# Altium schematic sheet 4_CONN.schdoc.schdoc
size 431 x 309 mm; Symbol: Sheet-Symbol_A3; Device: Sheet-Symbol_A3; Company: 嘉立创EDA; Version: V1.0; Page Size: A3; @Project Name: V3S_LCD; @Page Count: 4; @Update Date: 2023-12-17; @Create Date: 2023-12-16; @Schematic Name: Schematic1; @Page No: 4; @Page Name: CONN
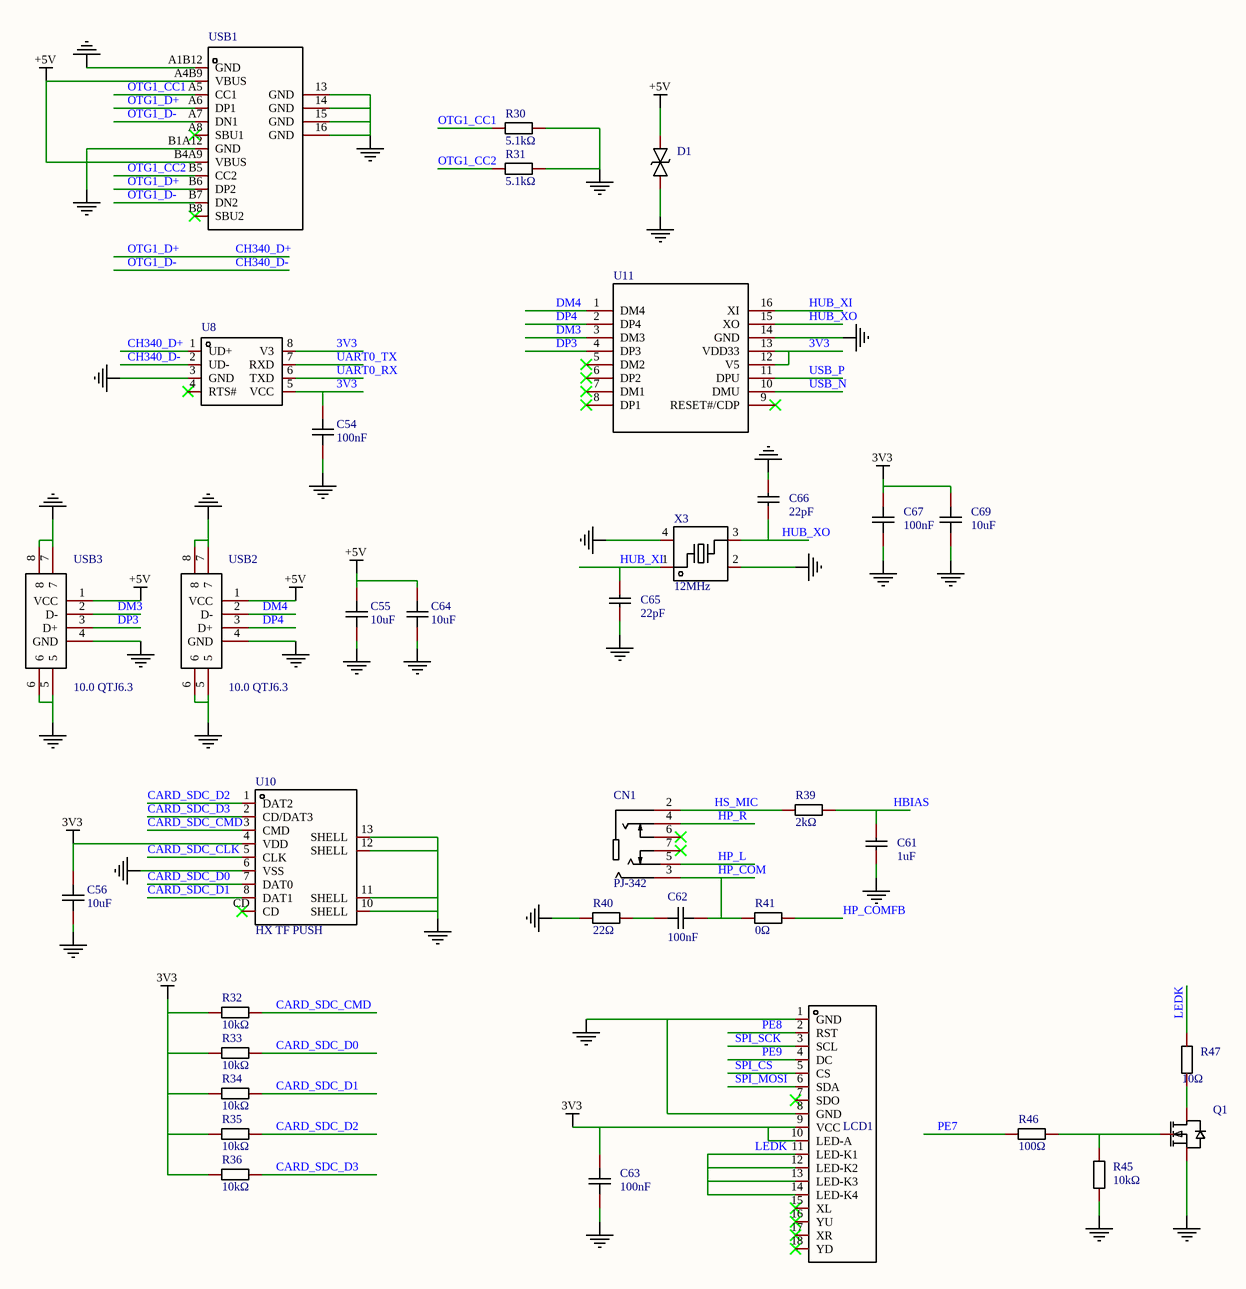
[diagram p0: 4_CONN.schdoc.schdoc]

## Parts
C54  100nF  [C0603]
C55  10uF  [C0603]
C56  10uF  [C0603]
C61  1uF  [C0603]
C62  100nF  [C0603]
C63  100nF  [C0603]
C64  10uF  [C0603]
C65  22pF  [C0603]
C66  22pF  [C0603]
C67  100nF  [C0603]
C69  10uF  [C0603]
CN1  PJ-342  [AUDIO-SMD_PJ-342]
D1  SMF5.0CA  [SOD-123_L2.7-W1.8-LS3.7-BI]  (value not drawn)
LCD1  TFT_2.4_18P_SPI_ILI9341_240X320_65K_S_1  [TFT_2.4_18P_SPI_ILI9341_240X320_65K_S_1]  (value not drawn)
Q1  ao3400_c841146  [SOT-23-3_L2.9-W1.3-P1.90-LS2.4-BR]  (value not drawn)
R30  5.1kΩ  [R0402]
R31  5.1kΩ  [R0402]
R32  10kΩ  [R0603]
R33  10kΩ  [R0603]
R34  10kΩ  [R0603]
R35  10kΩ  [R0603]
R36  10kΩ  [R0603]
R39  2kΩ  [R0603]
R40  22Ω  [R0603]
R41  0Ω  [R0603]
R45  10kΩ  [R0603]
R46  100Ω  [R0603]
R47  10Ω  [R0603]
U8  CH340N  [SOP-8_L4.9-W3.9-P1.27-LS6.0-BL]  (value not drawn)
U10  HX TF PUSH  [TF-SMD_TF-PUSH]
U11  CH334R  [QSOP-16_L4.9-W3.9-P0.635-LS6.0-BL]  (value not drawn)
USB1  TYPEC-304-BCP16  [USB-C-SMD_TYPEC-304-BCP16]  (value not drawn)
USB2  10.0 QTJ6.3  [USB-A-SMD_10.0-QTJ6.3]
USB3  10.0 QTJ6.3  [USB-A-SMD_10.0-QTJ6.3]
X3  12MHz  [OSC-SMD_4P-L3.2-W2.5-BL]

## Nets
3V3: C54.2 C56.2 C63.2 C67.2 C69.2 LCD1.9(VCC) LCD1.10(LED-A) R32.1 R33.1 R34.1 R35.1 R36.1 U8.5(VCC) U8.8(V3) U10.4(VDD) U11.12(V5) U11.13(VDD33)
+5V: C55.2 C64.2 D1.2 USB1.A4B9(VBUS) USB1.B4A9(VBUS) USB2.1(VCC) USB3.1(VCC)
GND: C54.1 C65.1 C66.2 D1.1 R30.2 R31.2 U8.3(GND) USB1.13(GND) USB1.14(GND) USB1.15(GND) USB1.16(GND) USB1.A1B12(GND) USB1.B1A12(GND) X3.2(GND) X3.4(GND)
NetC55_1: C55.1 C56.1 C61.1 C63.1 C64.1 C67.1 C69.1 LCD1.1(GND) LCD1.8(GND) Q1.2(S) R40.1 R45.1 U10.6(VSS) U10.10(SHELL) U10.11(SHELL) U10.12(SHELL) U10.13(SHELL) U11.14(GND) USB2.4(GND) USB2.5 USB2.6 USB2.7 USB2.8 USB3.4(GND) USB3.5 USB3.6 USB3.7 USB3.8
CARD_SDC_CLK: U10.5(CLK)
CARD_SDC_CMD: R32.2 U10.3(CMD)
CARD_SDC_D0: R33.2 U10.7(DAT0)
CARD_SDC_D1: R34.2 U10.8(DAT1)
CARD_SDC_D2: R35.2 U10.1(DAT2)
CARD_SDC_D3: R36.2 U10.2(CD/DAT3)
CH340_D+: U8.1(UD+) USB1.A6(DP1) USB1.B6(DP2)  [also labelled OTG1_D+]
CH340_D-: U8.2(UD-) USB1.A7(DN1) USB1.B7(DN2)  [also labelled OTG1_D-]
DM3: U11.3(DM3) USB3.2(D-)
DM4: U11.1(DM4) USB2.2(D-)
DP3: U11.4(DP3) USB3.3(D+)
DP4: U11.2(DP4) USB2.3(D+)
HBIAS: C61.2 R39.2
HP_COM: C62.1 CN1.3 R41.1
HP_COMFB: R41.2
HP_L: CN1.5
HP_R: CN1.4
HS_MIC: CN1.2 R39.1
HUB_XI: C65.2 U11.16(XI) X3.1
HUB_XO: C66.1 U11.15(XO) X3.3
LEDK: LCD1.11(LED-K1) LCD1.12(LED-K2) LCD1.13(LED-K3) LCD1.14(LED-K4) R47.2
OTG1_CC1: R30.1 USB1.A5(CC1)
OTG1_CC2: R31.1 USB1.B5(CC2)
PE7: R46.1
PE8: LCD1.2(RST)
PE9: LCD1.4(DC)
SPI_CS: LCD1.5(CS)
SPI_MOSI: LCD1.6(SDA)
SPI_SCK: LCD1.3(SCL)
UART0_RX: U8.6(TXD)
UART0_TX: U8.7(RXD)
USB_N: U11.10(DMU)
USB_P: U11.11(DPU)
NetC62_2: C62.2 R40.2
NetQ1_1: Q1.1(G) R45.2 R46.2
NetQ1_3: Q1.3(D) R47.1

Not connected (* = marked no-connect by the designer): CN1 6* 7*; LCD1 7(SDO)* 15(XL)* 16(YU)* 17(XR)* 18(YD)*; U8 4(RTS#)*; U10 CD*; U11 5(DM2)* 6(DP2)* 7(DM1)* 8(DP1)* 9(RESET#/CDP)*; USB1 A8(SBU1)* B8(SBU2)*

## Notes on the sheet
- 1
- 2
- 3
- 4
- 5
- 6
- A
- B
- C
- 原理图
- Schematic1
- 创建日期
- 更新日期
- 2023-12-17
- 2023-12-16
- D
- 审阅
- 绘制
- 图页
- CONN
- 物料编码
- V3S_LCD
- 版本
- 尺寸
- 页
- 共
- V1.0
- A3
- 嘉立创EDA

## Library data of the parts
C54 C62 C63 C67 = CC0603KRX7R9BB104: Manufacturer: YAGEO(国巨); Add into BOM: yes; Tolerance: ±10%; Voltage Rated: 50V; Temperature Coefficient: X7R; Description: 容值:100nF;精度:±10%;额定电压:50V;材质(温度系数):X7R;; Name: 100nF; Symbol: CC0603KRX7R9BB104; Device: CC0603KRX7R9BB104; Supplier: LCSC; Manufacturer Part: CC0603KRX7R9BB104; Value: 100nF; Supplier Part: C14663; JLCPCB Part Class: Basic Part; LCSC Part Name: 100nF ±10% 50V; Supplier Footprint: 0603; Datasheet: https://atta.szlcsc.com/upload/public/pdf/source/20180910/C282072_33301C7F631E79921B82A8DAC6BCC5B3.pdf; Convert to PCB: yes
C55 C56 C64 C69 = CL10A106KP8NNNC: Manufacturer: SAMSUNG(三星); Add into BOM: yes; Tolerance: ±10%; Voltage Rated: 10V; Temperature Coefficient: X5R; Description: 容值:10uF;精度:±10%;额定电压:10V;材质(温度系数):X5R;; Name: 10uF; Symbol: CL10A106KP8NNNC; Device: CL10A106KP8NNNC; Supplier: LCSC; Manufacturer Part: CL10A106KP8NNNC; Value: 10uF; Supplier Part: C19702; LCSC Part Name: 10uF ±10% 10V; Supplier Footprint: 0603; Convert to PCB: yes
  C55 C56 C64: JLCPCB Part Class: Basic Part; Datasheet: https://atta.szlcsc.com/upload/public/pdf/source/20160103/1457707703378.pdf
  C69: JLCPCB Part Class: 基础库; Datasheet: https://atta.szlcsc.com/upload/public/pdf/source/20160218/1457707763339.pdf
C61 = CL10A105KB8NNNC: Manufacturer: SAMSUNG(三星); Add into BOM: yes; Tolerance: ±10%; Voltage Rated: 50V; Temperature Coefficient: X5R; Description: 容值:1uF;精度:±10%;额定电压:50V;材质(温度系数):X5R;; Name: 1uF; Symbol: CL10A105KB8NNNC; Device: CL10A105KB8NNNC; Supplier: LCSC; Manufacturer Part: CL10A105KB8NNNC; Value: 1uF; Supplier Part: C15849; JLCPCB Part Class: Basic Part; LCSC Part Name: 1uF ±10% 50V; Supplier Footprint: 0603; Datasheet: https://atta.szlcsc.com/upload/public/pdf/source/20160218/1457707763339.pdf; Convert to PCB: yes
C65 C66 = CL10C220JB8NNNC: Manufacturer: SAMSUNG(三星); Add into BOM: yes; Tolerance: ±5%; Voltage Rated: 50V; Temperature Coefficient: C0G; Description: 容值:22pF;精度:±5%;额定电压:50V;材质(温度系数):C0G;; Name: 22pF; Symbol: CL10C220JB8NNNC; Device: CL10C220JB8NNNC; Supplier: LCSC; Manufacturer Part: CL10C220JB8NNNC; Value: 22pF; Supplier Part: C1653; JLCPCB Part Class: 基础库; LCSC Part Name: 22pF ±5% 50V; Supplier Footprint: 0603; Datasheet: https://atta.szlcsc.com/upload/public/pdf/source/20160218/1457707763339.pdf; Convert to PCB: yes
CN1 = PJ-342_C668606: Manufacturer: SHOU HAN(首韩); Add into BOM: yes; Connector Type: 3.5mm耳机座; Current Rating (Max): 500mA; Voltage Rating (Max): 30V; Description: 连接器类型:3.5mm耳机座;额定电流:500mA;额定电压:30V;工作温度范围:-30℃~+70℃;; Name: PJ-342; Symbol: PJ-342; Device: PJ-342_C668606; LCSC Part Name: 3.5mm耳机座; Supplier Part: C668606; Manufacturer Part: PJ-342; Supplier Footprint: SMD; JLCPCB Part Class: 扩展库; Datasheet: https://atta.szlcsc.com/upload/public/pdf/source/20200618/C668606_D9051A7D9D1D8CCDEAA76A8E7BC279ED.pdf; Supplier: LCSC; Convert to PCB: yes; Operating Temperature Range: -30℃~+70℃
D1 = SMF5.0CA_C435453: 极性:双向;反向截止电压(Vrwm):5V;击穿电压:6.4V;反向漏电流(Ir):800uA;峰值脉冲电流(Ipp)@10/1000μs:21.7A;最大钳位电压:9.2V;; Manufacturer: AnBon(安邦); Add into BOM: yes; Polarity: 双向; Reverse Stand-Off Voltage (Vrwm): 5V; Breakdown Voltage: 6.4V; Reverse Leakage Current (Ir): 800uA; Peak Pulse Current (Ipp)@10/1000μs: 21.7A; Maximum Clamping Voltage: 9.2V; Name: SMF5.0CA; Symbol: SMF5.0CA_C435453; Device: SMF5.0CA_C435453; LCSC Part Name: 双向 Vrwm:5V; Supplier Part: C435453; Manufacturer Part: SMF5.0CA; Supplier Footprint: SOD-123; JLCPCB Part Class: Extended Part; Datasheet: https://atta.szlcsc.com/upload/public/pdf/source/20191009/C435453_6D1091435A92BAD2FCEBAFDAD46121CC.pdf; Supplier: LCSC; Convert to PCB: yes
LCD1 = TFT_2.4_18P_SPI_ILI9341_240X320_65K_S_1: Add into BOM: yes; Description: 2.4寸SPI串口液晶屏TFT彩屏ILI9341驱动; Symbol: TFT_2.4_18P_SPI_ILI9341_240X320_65K_S_1; Device: TFT_2.4_18P_SPI_ILI9341_240X320_65K_S_1; Convert to PCB: yes
Q1 = ao3400_c841146: 类型:N沟道;漏源电压(Vdss):30V;连续漏极电流(Id):5.8A;功率(Pd):1.4W;导通电阻(RDS(on)@Vgs,Id):28m@10V,2.9A;阈值电压(Vgs(th)@Id):900mV@250uA;栅极电荷(Qg@Vgs):9.5nC@4.5V;输入电容(Ciss@Vds):623pF@15V;反向传输电容(Crss@Vds):77pF@15V;工作温度:-55~+150@(Tj);; Manufacturer: LGE(鲁光); Manufacturer Part: AO3400; Add into BOM: yes; Type: N沟道; Drain Source Voltage (Vdss): 30V; Continuous Drain Current (Id): 5.8A; Power Dissipation (Pd): 1.4W; Symbol: AO3400_C841146; Device: ao3400_c841146; Supplier: LCSC; Supplier Part: C841146; JLCPCB Part Class: Extended Part; LCSC Part Name: N沟道 30V 5.8A; Supplier Footprint: SOT-23; Datasheet: https://atta.szlcsc.com/upload/public/pdf/source/20200922/C841146_922AA0BEFDBB3A3B608547560AFF8EA3.pdf; Convert to PCB: yes; Drain Source On Resistance (RDS(on)@Vgs,Id): 28m@10V,2.9A; Gate Threshold Voltage (Vgs(th)@Id): 900mV@250uA; Total Gate Charge (Qg@Vgs): 9.5nC@4.5V; Input Capacitance (Ciss@Vds): 623pF@15V; Reverse Transfer Capacitance (Crss@Vds): 77pF@15V; Operating Temperature: -55~+150@(Tj)
R30 R31 = 0402WGF5101TCE: Manufacturer: UNI-ROYAL(厚声); Add into BOM: yes; Tolerance: ±1%; Power(Watts): 62.5mW; Overload Voltage (Max): 50V; Temperature Coefficient: ±100ppm/℃; Description: 阻值:5.1kΩ;精度:±1%;功率:62.5mW;温度系数:±100ppm/℃;电阻类型:厚膜电阻;; Name: 5.1kΩ; Symbol: 0402WGF5101TCE; Device: 0402WGF5101TCE; Supplier: LCSC; Manufacturer Part: 0402WGF5101TCE; Supplier Part: C25905; Value: 5.1kΩ; JLCPCB Part Class: 基础库; LCSC Part Name: 5.1kΩ ±1% 62.5mW 厚膜电阻; Supplier Footprint: 0402; Datasheet: https://atta.szlcsc.com/upload/public/pdf/source/20200306/C422600_1E6D84923E4A46A82E41ADD87F860B5C.pdf; Convert to PCB: yes; Type: 厚膜电阻; Operating Temperature Range: -55℃~+155℃
R32-R36 = 0603WAF1002T5E: 电阻类型:厚膜电阻;阻值:10kΩ;精度:±1%;功率:100mW;温度系数:±100ppm/℃;最大工作电压:75V;工作温度范围:-55℃~+155℃;; Manufacturer: UNI-ROYAL(厚声); Add into BOM: yes; Tolerance: ±1%; Power(Watts): 100mW; Overload Voltage (Max): 75V; Name: 10kΩ; Symbol: 0603WAF1002T5E; Device: 0603WAF1002T5E; Supplier: LCSC; Manufacturer Part: 0603WAF1002T5E; Supplier Part: C25804; Value: 10kΩ; JLCPCB Part Class: Basic Part; LCSC Part Name: 10kΩ ±1% 100mW; Supplier Footprint: 0603; Datasheet: https://atta.szlcsc.com/upload/public/pdf/source/20200306/C422600_1E6D84923E4A46A82E41ADD87F860B5C.pdf; Convert to PCB: yes; Temperature Coefficient: ±100ppm/℃; Type: 厚膜电阻; Operating Temperature Range: -55℃~+155℃
R39 = 0603WAF2001T5E: Manufacturer: UNI-ROYAL(厚声); Add into BOM: yes; Tolerance: ±1%; Power(Watts): 100mW; Overload Voltage (Max): 75V; Temperature Coefficient: ±100ppm/℃; Description: 阻值:2kΩ;精度:±1%;功率:100mW;温度系数:±100ppm/℃;电阻类型:厚膜电阻;; Name: 2kΩ; Symbol: 0603WAF2001T5E; Device: 0603WAF2001T5E; Supplier: LCSC; Manufacturer Part: 0603WAF2001T5E; Supplier Part: C22975; Value: 2kΩ; JLCPCB Part Class: Basic Part; LCSC Part Name: 2kΩ ±1% 100mW 厚膜电阻; Supplier Footprint: 0603; Datasheet: https://atta.szlcsc.com/upload/public/pdf/source/20200306/C422600_1E6D84923E4A46A82E41ADD87F860B5C.pdf; Convert to PCB: yes; Type: 厚膜电阻; Operating Temperature Range: -55℃~+155℃
R40 = 0603WAF220JT5E: Manufacturer: UNI-ROYAL(厚声); Add into BOM: yes; Tolerance: ±1%; Power(Watts): 100mW; Overload Voltage (Max): 75V; Temperature Coefficient: ±100ppm/℃; Description: 阻值:22Ω;精度:±1%;功率:100mW;温度系数:±100ppm/℃;电阻类型:厚膜电阻;; Name: 22Ω; Symbol: 0603WAF220JT5E; Device: 0603WAF220JT5E; Supplier: LCSC; Manufacturer Part: 0603WAF220JT5E; Supplier Part: C23345; Value: 22Ω; JLCPCB Part Class: Basic Part; LCSC Part Name: 22Ω ±1% 100mW 厚膜电阻; Supplier Footprint: 0603; Datasheet: https://atta.szlcsc.com/upload/public/pdf/source/20200306/C422600_1E6D84923E4A46A82E41ADD87F860B5C.pdf; Convert to PCB: yes; Type: 厚膜电阻; Operating Temperature Range: -55℃~+155℃
R41 = 0603WAF0000T5E: Manufacturer: UNI-ROYAL(厚声); Add into BOM: yes; Tolerance: ±1%; Power(Watts): 100mW; Overload Voltage (Max): 75V; Description: 阻值:0Ω;精度:±1%;功率:100mW;电阻类型:厚膜电阻;; Name: 0Ω; Symbol: 0603WAF0000T5E; Device: 0603WAF0000T5E; Supplier: LCSC; Manufacturer Part: 0603WAF0000T5E; Supplier Part: C21189; Value: 0Ω; JLCPCB Part Class: Basic Part; LCSC Part Name: 0Ω ±1% 100mW 厚膜电阻; Supplier Footprint: 0603; Datasheet: https://atta.szlcsc.com/upload/public/pdf/source/20200306/C422600_1E6D84923E4A46A82E41ADD87F860B5C.pdf; Convert to PCB: yes; Type: 厚膜电阻; Operating Temperature Range: -55℃~+155℃
R45 = 0603WAF1002T5E: Manufacturer: UNI-ROYAL(厚声); Add into BOM: yes; Tolerance: ±1%; Power(Watts): 100mW; Overload Voltage (Max): 75V; Temperature Coefficient: ±100ppm/℃; Description: 阻值:10kΩ;精度:±1%;功率:100mW;温度系数:±100ppm/℃;电阻类型:厚膜电阻;; Name: 10kΩ; Symbol: 0603WAF1002T5E; Device: 0603WAF1002T5E; Supplier: LCSC; Manufacturer Part: 0603WAF1002T5E; Supplier Part: C25804; Value: 10kΩ; JLCPCB Part Class: Basic Part; LCSC Part Name: 10kΩ ±1% 100mW 厚膜电阻; Supplier Footprint: 0603; Datasheet: https://atta.szlcsc.com/upload/public/pdf/source/20200306/C422600_1E6D84923E4A46A82E41ADD87F860B5C.pdf; Convert to PCB: yes; Type: 厚膜电阻; Operating Temperature Range: -55℃~+155℃
R46 = 0603WAF1000T5E: Manufacturer: UNI-ROYAL(厚声); Add into BOM: yes; Tolerance: ±1%; Power(Watts): 100mW; Overload Voltage (Max): 75V; Temperature Coefficient: ±200ppm/℃; Description: 阻值:100Ω;精度:±1%;功率:100mW;温度系数:±200ppm/℃;电阻类型:厚膜电阻;; Name: 100Ω; Symbol: 0603WAF1000T5E; Device: 0603WAF1000T5E; Supplier: LCSC; Manufacturer Part: 0603WAF1000T5E; Supplier Part: C22775; Value: 100Ω; JLCPCB Part Class: Basic Part; LCSC Part Name: 100Ω ±1% 100mW 厚膜电阻; Supplier Footprint: 0603; Datasheet: https://atta.szlcsc.com/upload/public/pdf/source/20200306/C422600_1E6D84923E4A46A82E41ADD87F860B5C.pdf; Convert to PCB: yes; Type: 厚膜电阻; Operating Temperature Range: -55℃~+155℃
R47 = 0603WAF100JT5E: Manufacturer: UNI-ROYAL(厚声); Add into BOM: yes; Tolerance: ±1%; Power(Watts): 100mW; Temperature Coefficient: ±400ppm/℃; Overload Voltage (Max): 75V; Description: 电阻类型:厚膜电阻;阻值:10Ω;精度:±1%;功率:100mW;温度系数:±400ppm/℃;最大工作电压:75V;工作温度范围:-55℃~+155℃;; Name: 10Ω; Symbol: 0603WAF100JT5E; Device: 0603WAF100JT5E; LCSC Part Name: 10Ω ±1% 100mW; Supplier Part: C22859; Manufacturer Part: 0603WAF100JT5E; Supplier Footprint: 0603; JLCPCB Part Class: Basic Part; Datasheet: https://atta.szlcsc.com/upload/public/pdf/source/20200306/C422600_1E6D84923E4A46A82E41ADD87F860B5C.pdf; Supplier: LCSC; Convert to PCB: yes; Type: 厚膜电阻; Value: 10Ω; Operating Temperature Range: -55℃~+155℃
U8 = CH340N: Manufacturer: WCH(南京沁恒); Symbol: CH340N_C2977777; Add into BOM: yes; Device: CH340N; Supplier: LCSC; Supplier Part: C2977777; Manufacturer Part: CH340N; JLCPCB Part Class: Extended Part; LCSC Part Name: CH340N; Supplier Footprint: SOP-8; Datasheet: https://atta.szlcsc.com/upload/public/pdf/source/20220223/82A45E4FF89B3EDCAD50B354450A7EF4.pdf; Convert to PCB: yes
U10 = HX TF PUSH: Manufacturer: hanxia(韩下); Add into BOM: yes; Name: HX TF PUSH; Symbol: HX TF PUSH; Device: HX TF PUSH; LCSC Part Name: 自弹式TF卡座 TF外焊式内存卡卡座 带丝印; Supplier Part: C5184837; Manufacturer Part: HX TF PUSH; Supplier Footprint: SMD; JLCPCB Part Class: Extended Part; Datasheet: https://atta.szlcsc.com/upload/public/pdf/source/20221008/37482DBF64DAC27DC2B42D30360A57C3.pdf; Supplier: LCSC; Convert to PCB: yes
U11 = CH334R: Convert to PCB: yes; Symbol: CH334R; Device: CH334R; Add into BOM: yes
USB1 = TYPEC-304-BCP16_C720629: Manufacturer: XUNPU(讯普); Add into BOM: yes; Connector Type: Type-C; Gender: 母座; Number of Contacts: 16; Number of Ports: 1; Current Rating - Power (Max): 3A; Welding Temperature (Max): 260℃; Description: 连接器类型:Type-C;标准:USB 3.1;公母:母座;触点数量:16;端口数量:1;安装方式:卧贴;额定电流 - 电源:3A;工作温度范围:-25℃~+85℃;焊接温度(最大值):260℃;; Name: TYPEC-304-BCP16; Symbol: TYPEC-304-BCP16; Device: TYPEC-304-BCP16_C720629; Supplier: LCSC; Supplier Part: C720629; Manufacturer Part: TYPEC-304-BCP16; JLCPCB Part Class: Extended Part; LCSC Part Name: Type-C 母座 卧贴 停产 停产; Supplier Footprint: SMD; Datasheet: https://atta.szlcsc.com/upload/public/pdf/source/20220210/1FE0FEFF7D6A20C111212527D3DED014.pdf; Convert to PCB: yes; Standard: USB 3.1; Mounting Style: 卧贴; Operating Temperature Range: -25℃~+85℃
USB2 USB3 = 10.0 QTJ6.3: Manufacturer: SHOU HAN(首韩); Add into BOM: yes; Connector Type: Type-A; Gender: 母; Number of Contacts: 4P; Number of Ports: 1; Description: 连接器类型:Type-A;标准:USB 2.0;公母:母;触点数量:4P;端口数量:1;安装方式:卧贴;额定电流 - 电源:-;工作温度范围:-;; Name: 10.0 QTJ6.3; Symbol: 10.0 QTJ6.3; Device: 10.0 QTJ6.3; Supplier: LCSC; Supplier Part: C404966; Manufacturer Part: 10.0 QTJ6.3; JLCPCB Part Class: 扩展库; LCSC Part Name: Type-A 母 卧贴 短体180度全贴片式 铁壳LCP黑胶6,3 卷边; Supplier Footprint: SMD; Datasheet: https://atta.szlcsc.com/upload/public/pdf/source/20190722/C404966_79EC905EA469D8992CE6A4D8B32C5E15.pdf; Convert to PCB: yes; Standard: USB 2.0; Mounting Style: 卧贴; Current Rating - Power (Max): -; Operating Temperature Range: -
X3 = XL2EL89COI-111YLC-12M: Manufacturer: YXC(扬兴晶振); Add into BOM: yes; Crystal Type: 贴片无源晶振; Load Capacitance: 12pF; Frequency Tolerance: ±10ppm; Description: 频率:12MHz;负载电容:12pF;频率公差:±10ppm;; Name: 12MHz; Symbol: XL2EL89COI-111YLC-12M; Device: XL2EL89COI-111YLC-12M; Supplier: LCSC; Supplier Part: C5280578; Manufacturer Part: XL2EL89COI-111YLC-12M; Value: 12MHz; LCSC Part Name: 12MHz ±10ppm 12pF YSX321SL; Supplier Footprint: SMD3225-4P; Datasheet: https://atta.szlcsc.com/upload/public/pdf/source/20221123/F2BA42DE32ABBB38D40A6B8F76627591.pdf; Convert to PCB: yes